# EAGLE design ShieldSchemV22JUSTINV2 (EAGLE 5.10)
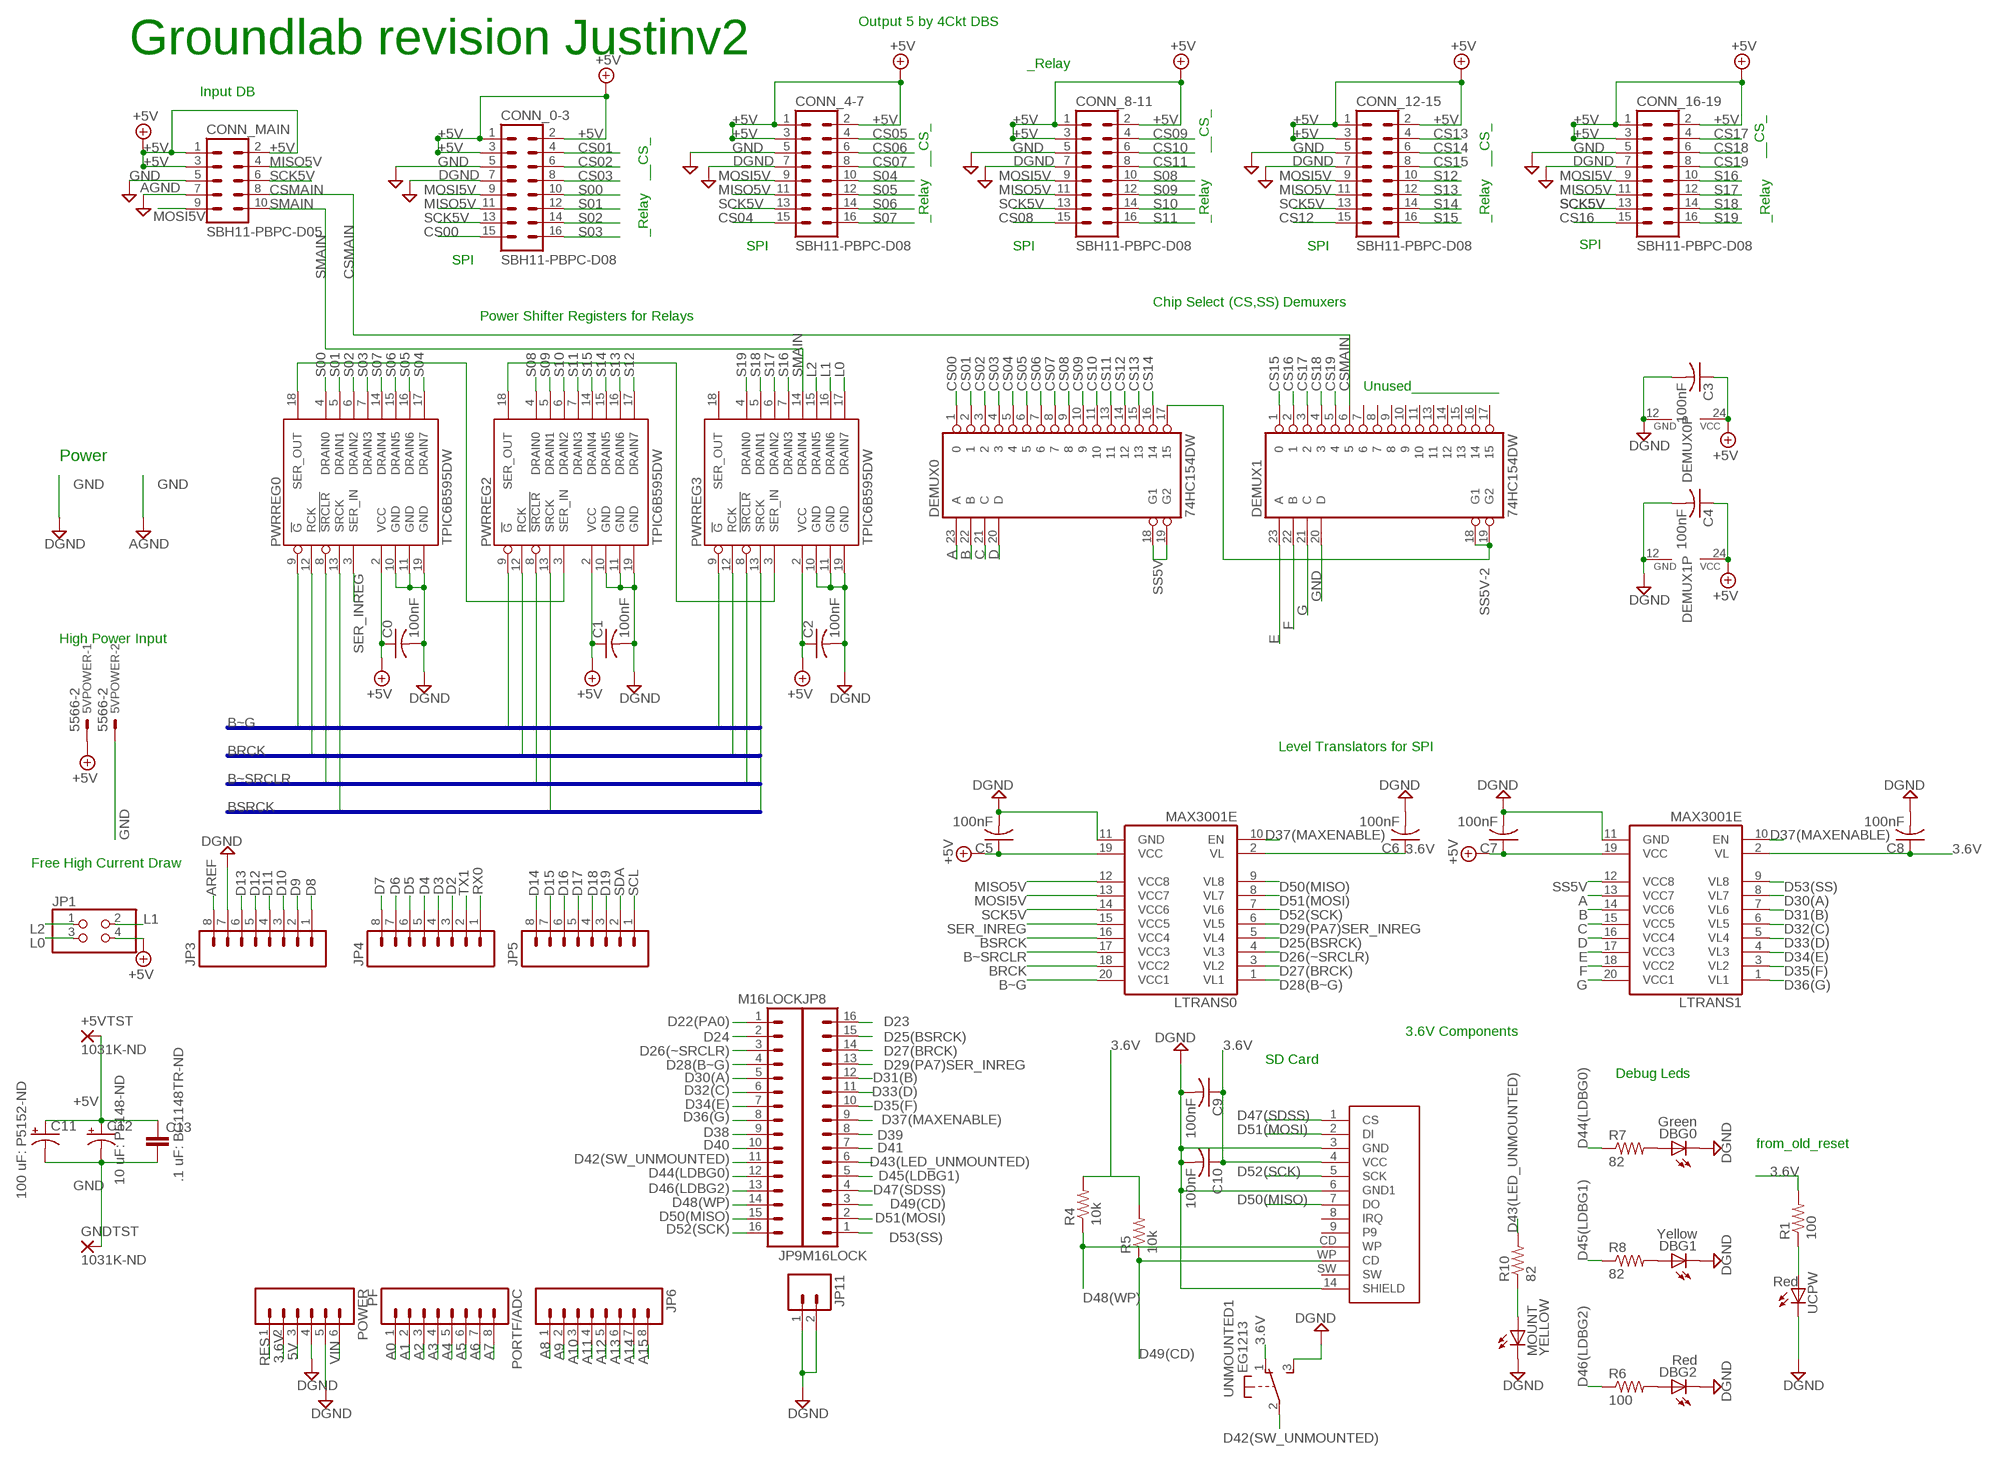
[diagram p0: schematic, sheet 1]

## Parts
5VPOWER  5566-2  [5566-2]
+5VTST  1031K-ND  2,54/0,9  [2,54/0,9]
C0  100nF  C-USC1608  [C1608]
C1  100nF  C-USC1608  [C1608]
C2  100nF  C-USC1608  [C1608]
C3  100nF  C-USC1608  [C1608]
C4  100nF  C-USC1608  [C1608]
C5  100nF  C-USC1608  [C1608]
C6  100nF  C-USC1608  [C1608]
C7  100nF  C-USC1608  [C1608]
C8  100nF  C-USC1608  [C1608]
C9  100nF  C-USC1608  [C1608]
C10  100nF  C-USC1608  [C1608]
C11  100 uF: P5152-ND  CAP_POLPTH1  [CPOL-RADIAL-100UF-25V]
C12  10 uF: P5148-ND  CAP_POLPTH2  [CPOL-RADIAL-10UF-25V]
C13  .1 uF: BC1148TR-ND  CAPPTH  [CAP-PTH-SMALL]
CONN_0-3  SBH11-PBPC-D08  [SBH11-PBPC-D08]
CONN_4-7  SBH11-PBPC-D08  [SBH11-PBPC-D08]
CONN_8-11  SBH11-PBPC-D08  [SBH11-PBPC-D08]
CONN_12-15  SBH11-PBPC-D08  [SBH11-PBPC-D08]
CONN_16-19  SBH11-PBPC-D08  [SBH11-PBPC-D08]
CONN_MAIN  SBH11-PBPC-D05  [SBH11-PBPC-D05]
DBG0  Green  LEDCHIPLED_1206  [CHIPLED_1206]
DBG1  Yellow  LEDCHIPLED_1206  [CHIPLED_1206]
DBG2  Red  LEDCHIPLED_1206  [CHIPLED_1206]
DEMUX0  74HC154DW  [SO24W]
DEMUX1  74HC154DW  [SO24W]
GNDTST  1031K-ND  2,54/0,9  [2,54/0,9]
JP1  PINHD-2X2  [2X02]
JP3  M08LOCK  [1X08_LOCK]
JP4  M08LOCK  [1X08_LOCK]
JP5  M08LOCK  [1X08_LOCK]
JP6  M08LOCK  [1X08_LOCK]
JP8  M16LOCK  [1X16_LOCK]
JP9  M16LOCK  [1X16_LOCK]
JP11  M02LOCK  [1X02_LOCK]
LTRANS0  MAX3001E  [TSSOP20]
LTRANS1  MAX3001E  [TSSOP20]
MOUNT  YELLOW  LED5MM  [LED5MM]
PORTF/ADC  PF  M08LOCK  [1X08_LOCK]
POWER  M06LOCK  [1X06_LOCK]
PWRREG0  TPIC6B595DW  [SO20W]
PWRREG2  TPIC6B595DW  [SO20W]
PWRREG3  TPIC6B595DW  [SO20W]
R1  100  RESISTOR1206  [1206]
R4  10k  R-US_R1206  [R1206]
R5  10k  R-US_R1206  [R1206]
R6  100  R-US_R1206  [R1206]
R7  82  R-US_R1206  [R1206]
R8  82  R-US_M1206  [M1206]
R10  82  R-US_R1206  [R1206]
U$3  SD_CARD_SOCKETEASY_SOLDER  [SD-MMC_SOCKET-PP_SHORT_BUS]
UCPW  Red  LED1206  [LED-1206]
UNMOUNTED  EG1213  [EG1213]

## Nets
3.6V: C6.1 C8.1 C9.1 C10.1 LTRANS0.2(VL) LTRANS1.2(VL) POWER.2 R1.2 R4.2 R5.2 U$3.4(VCC) UNMOUNTED.1(1:O)
5V: POWER.3
+5V [+5v]: 5VPOWER.1 +5VTST.1(P) C0.1 C1.1 C2.1 C3.1 C4.1 C5.1 C7.1 C11.1(+) C12.1(+) C13.1 CONN_0-3.1 CONN_0-3.2 CONN_0-3.3 CONN_4-7.1 CONN_4-7.2 CONN_4-7.3 CONN_8-11.1 CONN_8-11.2 CONN_8-11.3 CONN_12-15.1 CONN_12-15.2 CONN_12-15.3 CONN_16-19.1 CONN_16-19.2 CONN_16-19.3 CONN_MAIN.1 CONN_MAIN.2 CONN_MAIN.3 DEMUX0.24(VCC) DEMUX1.24(VCC) JP1.4 LTRANS0.19(VCC) LTRANS1.19(VCC) PWRREG0.2(VCC) PWRREG2.2(VCC) PWRREG3.2(VCC)
A: DEMUX0.23(A) LTRANS1.13(VCC7)
A0: PORTF/ADC.1
A1: PORTF/ADC.2
A2: PORTF/ADC.3
A3: PORTF/ADC.4
A4: PORTF/ADC.5
A5: PORTF/ADC.6
A6: PORTF/ADC.7
A7: PORTF/ADC.8
A8: JP6.1
A9: JP6.2
A10: JP6.3
A11: JP6.4
A12: JP6.5
A13: JP6.6
A14: JP6.7
A15: JP6.8
AREF: JP3.8
B: DEMUX0.22(B) LTRANS1.14(VCC6)
BRCK: LTRANS0.18(VCC2) PWRREG0.12(RCK) PWRREG2.12(RCK) PWRREG3.12(RCK)
BSRCK: LTRANS0.16(VCC4) PWRREG0.13(SRCK) PWRREG2.13(SRCK) PWRREG3.13(SRCK)
B~G: LTRANS0.20(VCC1) PWRREG0.9(!G) PWRREG2.9(!G) PWRREG3.9(!G)
B~SRCLR: LTRANS0.17(VCC3) PWRREG0.8(!SRCLR) PWRREG2.8(!SRCLR) PWRREG3.8(!SRCLR)
C: DEMUX0.21(C) LTRANS1.15(VCC5)
CS00: CONN_0-3.15 DEMUX0.1
CS01: CONN_0-3.4 DEMUX0.2
CS02: CONN_0-3.6 DEMUX0.3
CS03: CONN_0-3.8 DEMUX0.4
CS04: CONN_4-7.15 DEMUX0.5
CS05: CONN_4-7.4 DEMUX0.6
CS06: CONN_4-7.6 DEMUX0.7
CS07: CONN_4-7.8 DEMUX0.8
CS08: CONN_8-11.15 DEMUX0.9
CS09: CONN_8-11.4 DEMUX0.10
CS10: CONN_8-11.6 DEMUX0.11
CS11: CONN_8-11.8 DEMUX0.13
CS12: CONN_12-15.15 DEMUX0.14
CS13: CONN_12-15.4 DEMUX0.15
CS14: CONN_12-15.6 DEMUX0.16
CS15: CONN_12-15.8 DEMUX1.1
CS16: CONN_16-19.15 DEMUX1.2
CS17: CONN_16-19.4 DEMUX1.3
CS18: CONN_16-19.6 DEMUX1.4
CS19: CONN_16-19.8 DEMUX1.5
CSMAIN: CONN_MAIN.8 DEMUX1.6
D: DEMUX0.20(D) LTRANS1.16(VCC4)
D2: JP4.3
D3: JP4.4
D4: JP4.5
D5: JP4.6
D6: JP4.7
D7: JP4.8
D8: JP3.1
D9: JP3.2
D10: JP3.3
D11: JP3.4
D12: JP3.5
D13: JP3.6
D14: JP5.8
D15: JP5.7
D16: JP5.6
D17: JP5.5
D18: JP5.4
D19: JP5.3
D22(PA0): JP9.1
D23: JP8.16
D24: JP9.2
D25(BSRCK): JP8.15 LTRANS0.5(VL4)
D26(~SRCLR): JP9.3 LTRANS0.4(VL3)
D27(BRCK): JP8.14 LTRANS0.3(VL2)
D28(B~G): JP9.4 LTRANS0.1(VL1)
D29(PA7)SER_INREG: JP8.13 LTRANS0.6(VL5)
D30(A): JP9.5 LTRANS1.8(VL7)
D31(B): JP8.12 LTRANS1.7(VL6)
D32(C): JP9.6 LTRANS1.6(VL5)
D33(D): JP8.11 LTRANS1.5(VL4)
D34(E): JP9.7 LTRANS1.4(VL3)
D35(F): JP8.10 LTRANS1.3(VL2)
D36(G): JP9.8 LTRANS1.1(VL1)
D37(MAXENABLE): JP8.9 LTRANS0.10(EN) LTRANS1.10(EN)
D38: JP9.9
D39: JP8.8
D40: JP9.10
D41: JP8.7
D42(SW_UNMOUNTED): JP9.11 UNMOUNTED.2(1:P)
D43(LED_UNMOUNTED): JP8.6 R10.2
D44(LDBG0): JP9.12 R7.1
D45(LDBG1): JP8.5 R8.1
D46(LDBG2): JP9.13 R6.1
D47(SDSS): JP8.4 U$3.1(CS)
D48(WP): JP9.14 R4.1 U$3.CD(WP)
D49(CD): JP8.3 R5.1 U$3.WP(CD)
D50(MISO): JP9.15 LTRANS0.9(VL8) U$3.7(DO)
D51(MOSI): JP8.2 LTRANS0.8(VL7) U$3.2(DI)
D52(SCK): JP9.16 LTRANS0.7(VL6) U$3.5(SCK)
D53(SS): JP8.1 LTRANS1.9(VL8)
E: DEMUX1.23(A) LTRANS1.17(VCC3)
F: DEMUX1.22(B) LTRANS1.18(VCC2)
G: DEMUX1.21(C) LTRANS1.20(VCC1)
GND: 5VPOWER.2 C0.2 C1.2 C2.2 C3.2 C4.2 C5.2 C6.2 C7.2 C8.2 C9.2 C10.2 C11.2(-) C12.2(-) C13.2 CONN_0-3.5 CONN_0-3.7 CONN_4-7.5 CONN_4-7.7 CONN_8-11.5 CONN_8-11.7 CONN_12-15.5 CONN_12-15.7 CONN_16-19.5 CONN_16-19.7 CONN_MAIN.5 CONN_MAIN.7 DBG0.C DBG1.C DBG2.C DEMUX0.12(GND) DEMUX1.12(GND) DEMUX1.20(D) GNDTST.1(P) JP3.7 JP11.1 JP11.2 LTRANS0.11(GND) LTRANS1.11(GND) MOUNT.K(C) POWER.4 POWER.5 PWRREG0.10(GND) PWRREG0.11(GND) PWRREG0.19(GND) PWRREG2.10(GND) PWRREG2.11(GND) PWRREG2.19(GND) PWRREG3.10(GND) PWRREG3.11(GND) PWRREG3.19(GND) U$3.3(GND) U$3.6(GND1) U$3.14(SHIELD) UCPW.C UNMOUNTED.3(1:S) ; supply symbol labelled DGND, AGND
L0: JP1.3 PWRREG3.17(DRAIN7)
L1: JP1.2 PWRREG3.16(DRAIN6)
L2: JP1.1 PWRREG3.15(DRAIN5)
MISO5V: CONN_0-3.11 CONN_4-7.11 CONN_8-11.11 CONN_12-15.11 CONN_16-19.11 CONN_MAIN.4 LTRANS0.12(VCC8)
MOSI5V: CONN_0-3.9 CONN_4-7.9 CONN_8-11.9 CONN_12-15.9 CONN_16-19.9 CONN_MAIN.9 LTRANS0.13(VCC7)
N$1: PWRREG0.18(SER_OUT) PWRREG2.3(SER_IN)
N$2: PWRREG2.18(SER_OUT) PWRREG3.3(SER_IN)
N$7: DBG2.A R6.2
N$8: DBG0.A R7.2
N$9: DBG1.A R8.2
N$11: MOUNT.A R10.1
N$126: R1.1 UCPW.A
RES: POWER.1
RX0: JP4.1
S00: CONN_0-3.10 PWRREG0.4(DRAIN0)
S01: CONN_0-3.12 PWRREG0.5(DRAIN1)
S02: CONN_0-3.14 PWRREG0.6(DRAIN2)
S03: CONN_0-3.16 PWRREG0.7(DRAIN3)
S04: CONN_4-7.10 PWRREG0.17(DRAIN7)
S05: CONN_4-7.12 PWRREG0.16(DRAIN6)
S06: CONN_4-7.14 PWRREG0.15(DRAIN5)
S07: CONN_4-7.16 PWRREG0.14(DRAIN4)
S08: CONN_8-11.10 PWRREG2.4(DRAIN0)
S09: CONN_8-11.12 PWRREG2.5(DRAIN1)
S10: CONN_8-11.14 PWRREG2.6(DRAIN2)
S11: CONN_8-11.16 PWRREG2.7(DRAIN3)
S12: CONN_12-15.10 PWRREG2.17(DRAIN7)
S13: CONN_12-15.12 PWRREG2.16(DRAIN6)
S14: CONN_12-15.14 PWRREG2.15(DRAIN5)
S15: CONN_12-15.16 PWRREG2.14(DRAIN4)
S16: CONN_16-19.10 PWRREG3.7(DRAIN3)
S17: CONN_16-19.12 PWRREG3.6(DRAIN2)
S18: CONN_16-19.14 PWRREG3.5(DRAIN1)
S19: CONN_16-19.16 PWRREG3.4(DRAIN0)
SCK5V: CONN_0-3.13 CONN_4-7.13 CONN_8-11.13 CONN_12-15.13 CONN_16-19.13 CONN_MAIN.6 LTRANS0.14(VCC6)
SCL: JP5.1
SDA: JP5.2
SER_INREG: LTRANS0.15(VCC5) PWRREG0.3(SER_IN)
SMAIN: CONN_MAIN.10 PWRREG3.14(DRAIN4)
SS5V: DEMUX0.18(G1) DEMUX0.19(G2) LTRANS1.12(VCC8)
SS5V-2: DEMUX0.17 DEMUX1.18(G1) DEMUX1.19(G2)
TX1: JP4.2
VIN: POWER.6
Unconnected: DEMUX1.7 DEMUX1.8 DEMUX1.9 DEMUX1.10 DEMUX1.11 DEMUX1.13 DEMUX1.14 DEMUX1.15 DEMUX1.16 DEMUX1.17 PWRREG3.18(SER_OUT) U$3.8(IRQ) U$3.9 U$3.SW UNMOUNTED.MT1(MT) UNMOUNTED.MT2(MT)

## Buses
BRCK
B~SRCLR
BSRCK
B~G

## Notes on the sheet
- Output 5 by 4Ckt DBS
- Groundlab revision Justinv2
- _Relay
- Input DB
- __CS_
- __CS_
- __CS_ | __CS_
- __CS_
- _Relay | _Relay | _Relay | _Relay
- _Relay
- SPI | SPI | SPI | SPI
- SPI
- Chip Select (CS,SS) Demuxers
- Power Shifter Registers for Relays
- Unused___________
- Power
- High Power Input
- Level Translators for SPI
- Free High Current Draw
- 3.6V Components
- SD Card
- Debug Leds
- from_old_reset

## Library data of the parts
5VPOWER = con-molex:5566-2: Mini FIT connector 2 pol Source: http://www.molex.com
+5VTST GNDTST = wirepad:2,54/0,9: THROUGH-HOLE PAD
C0 C1-C10 = rcl:C-US: CAPACITOR, American symbol
C11 C12 = SparkFun:CAP_POL: Capacitor Polarized These are standard SMD and PTH capacitors. Normally 10uF, 47uF, and 100uF in electrolytic and tantalum varieties. Always verify the external diameter of the through hole cap, it varies with capacity, voltage, and manufacturer. The EIA devices should be standard.
C13 = SparkFun:CAP: Capacitor Standard 0603 ceramic capacitor, and 0.1" leaded capacitor.
CONN_0-3 CONN_4-7 CONN_8-11 CONN_12-15 CONN_16-19 = con-sullins:SBH11-PBPC-D08: HEADER - Vertical, Shrouded
CONN_MAIN = con-sullins:SBH11-PBPC-D05: HEADER - Vertical, Shrouded
DBG0 DBG1 DBG2 MOUNT = led:LED: LED OSRAM: - CHIPLED LG R971, LG N971, LY N971, LG Q971, LY Q971, LO R971, LY R971 LH N974, LH R974 LS Q976, LO Q976, LY Q976 LO Q996 - Hyper CHIPLED LW Q18S LB Q993, LB Q99A, LB R99A - SideLED LS A670, LO A670, LY A670, LG A670, LP A670 LB A673, LV A673, LT A673, LW A673 LH A674 LY A675 LS A676, LA A676, LO A676, LY A676, LW A676 LS A679, LY A679, LG A679 - Hyper Micro SIDELED® LS Y876, LA Y876, LO Y876, LY Y876 LT Y87S - SmartLED LW L88C, LW L88S LB L89C, LB L89S, LG L890 LS L89K, LO L89K, LY L89K LS L896, LA L896, LO L896, LY L896 - TOPLED LS T670, LO T670, LY T670, LG T670, LP T670 LSG T670, LSP T670, LSY T670, LOP T670, LYG T670 LG T671, LOG T671, LSG T671 LB T673, LV T673, LT T673, LW T673 LH T674 LS T676, LA T676, LO T676, LY T676, LB T676, LH T676, LSB T676, LW T676 LB T67C, LV T67C, LT T67C, LS T67K, LO T67K, LY T67K, LW E67C LS E67B, LA E67B, LO E67B, LY E67B, LB E67C, LV E67C, LT E67C LW T67C LS T679, LY T679, LG T679 LS T770, LO T770, LY T770, LG T770, LP T770 LB T773, LV T773, LT T773, LW T773 LH T774 LS E675, LA E675, LY E675, LS T675 LS T776, LA T776, LO T776, LY T776, LB T776 LHGB T686 LT T68C, LB T68C - Hyper Mini TOPLED® LB M676 - Mini TOPLED Santana® LG M470 LS M47K, LO M47K, LY M47K Source: http://www.osram.convergy.de LUXEON: - LUMILED® LXK2-PW12-R00, LXK2-PW12-S00, LXK2-PW14-U00, LXK2-PW14-V00 LXK2-PM12-R00, LXK2-PM12-S00, LXK2-PM14-U00 LXK2-PE12-Q00, LXK2-PE12-R00, LXK2-PE12-S00, LXK2-PE14-T00, LXK2-PE14-U00 LXK2-PB12-K00, LXK2-PB12-L00, LXK2-PB12-M00, LXK2-PB14-N00, LXK2-PB14-P00, LXK2-PB14-Q00 LXK2-PR12-L00, LXK2-PR12-M00, LXK2-PR14-Q00, LXK2-PR14-R00 LXK2-PD12-Q00, LXK2-PD12-R00, LXK2-PD12-S00 LXK2-PH12-R00, LXK2-PH12-S00 LXK2-PL12-P00, LXK2-PL12-Q00, LXK2-PL12-R00 Source: www.luxeon.com KINGBRIGHT: KA-3528ASYC Source: www.kingbright.com
DEMUX0 DEMUX1 = 74xx-eu:74*154: 4-line to 16-line data SELECTOR/MULTIPLEXER
JP1 = pinhead:PINHD-2X2: PIN HEADER
JP3-JP6 PORTF/ADC = SparkFun:M08: Header 8 Standard 8-pin 0.1" header. Use with straight break away headers (SKU : PRT-00116), right angle break away headers (PRT-00553), swiss pins (PRT-00743), machine pins (PRT-00117), and female headers (PRT-00115).
JP8 JP9 = SparkFun:M16
JP11 = SparkFun:M02: Header 2 Standard 2-pin 0.1" header. Use with straight break away headers (SKU : PRT-00116), right angle break away headers (PRT-00553), swiss pins (PRT-00743), machine pins (PRT-00117), and female headers (PRT-00115). Molex polarized connector foot print use with SKU : PRT-08233 with associated crimp pins and housings.
LTRANS0 LTRANS1 = MAX3001E:MAX3001E
POWER = SparkFun:M06: Header 6 Standard 6-pin 0.1" header. Use with straight break away headers (SKU : PRT-00116), right angle break away headers (PRT-00553), swiss pins (PRT-00743), machine pins (PRT-00117), and female headers (PRT-00115). Molex polarized connector foot print use with SKU : PRT-08094 with associated crimp pins and housings. NOTES ON THE VARIANTS LOCK and LOCK_LONGPADS... This footprint was designed to help hold the alignment of a through-hole component (i.e. 6-pin header) while soldering it into place. You may notice that each hole has been shifted either up or down by 0.005 of an inch from it's more standard position (which is a perfectly straight line). This slight alteration caused the pins (the squares in the middle) to touch the edges of the holes. Because they are alternating, it causes a "brace" to hold the component in place. 0.005 has proven to be the perfect amount of "off-center" position when using our standard breakaway headers. Although looks a little odd when you look at the bare footprint, once you have a header in there, the alteration is very hard to notice. Also, if you push a header all the way into place, it is covered up entirely on the bottom side. This idea of altering the position of holes to aid alignment will be further integrated into the Sparkfun Library for other footprints. It can help hold any component with 3 or more connection pins.
PWRREG0 PWRREG2 PWRREG3 = TPIC6B595:TPIC6B595
R1 = SparkFun:RESISTOR: Resistor Basic schematic elements and footprints for 0603, 1206, and PTH 1/10th watt (small) resistors.
R4-R8 R10 = rcl:R-US_: RESISTOR, American symbol
U$3 = SparkFun:SD_CARD_SOCKET: SD/MMC Socket Media socket for SD and MMC cards. Push-push type. Schematic element and footprint production proven. Spark Fun Electronics SKU : PRT-00136
UCPW = SparkFun:LED: LEDs Standard schematic elements and footprints for 5mm, 3mm, 1206, and 0603 sized LEDs. 5mm - Spark Fun Electronics SKU : COM-00529 (and others)
UNMOUNTED = adafruit:EG1213: E-Switch right-angle slide SPDT Part #EG1213 http://www.ladyada.net/library/eagle

## Net classes
0 default: width 0.254 mm, drill 0.61 mm, clearance 0.254 mm
1 +5v: width 1.27 mm, drill 0.61 mm
2 GND: width 1.27 mm, drill 0.61 mm

## Board
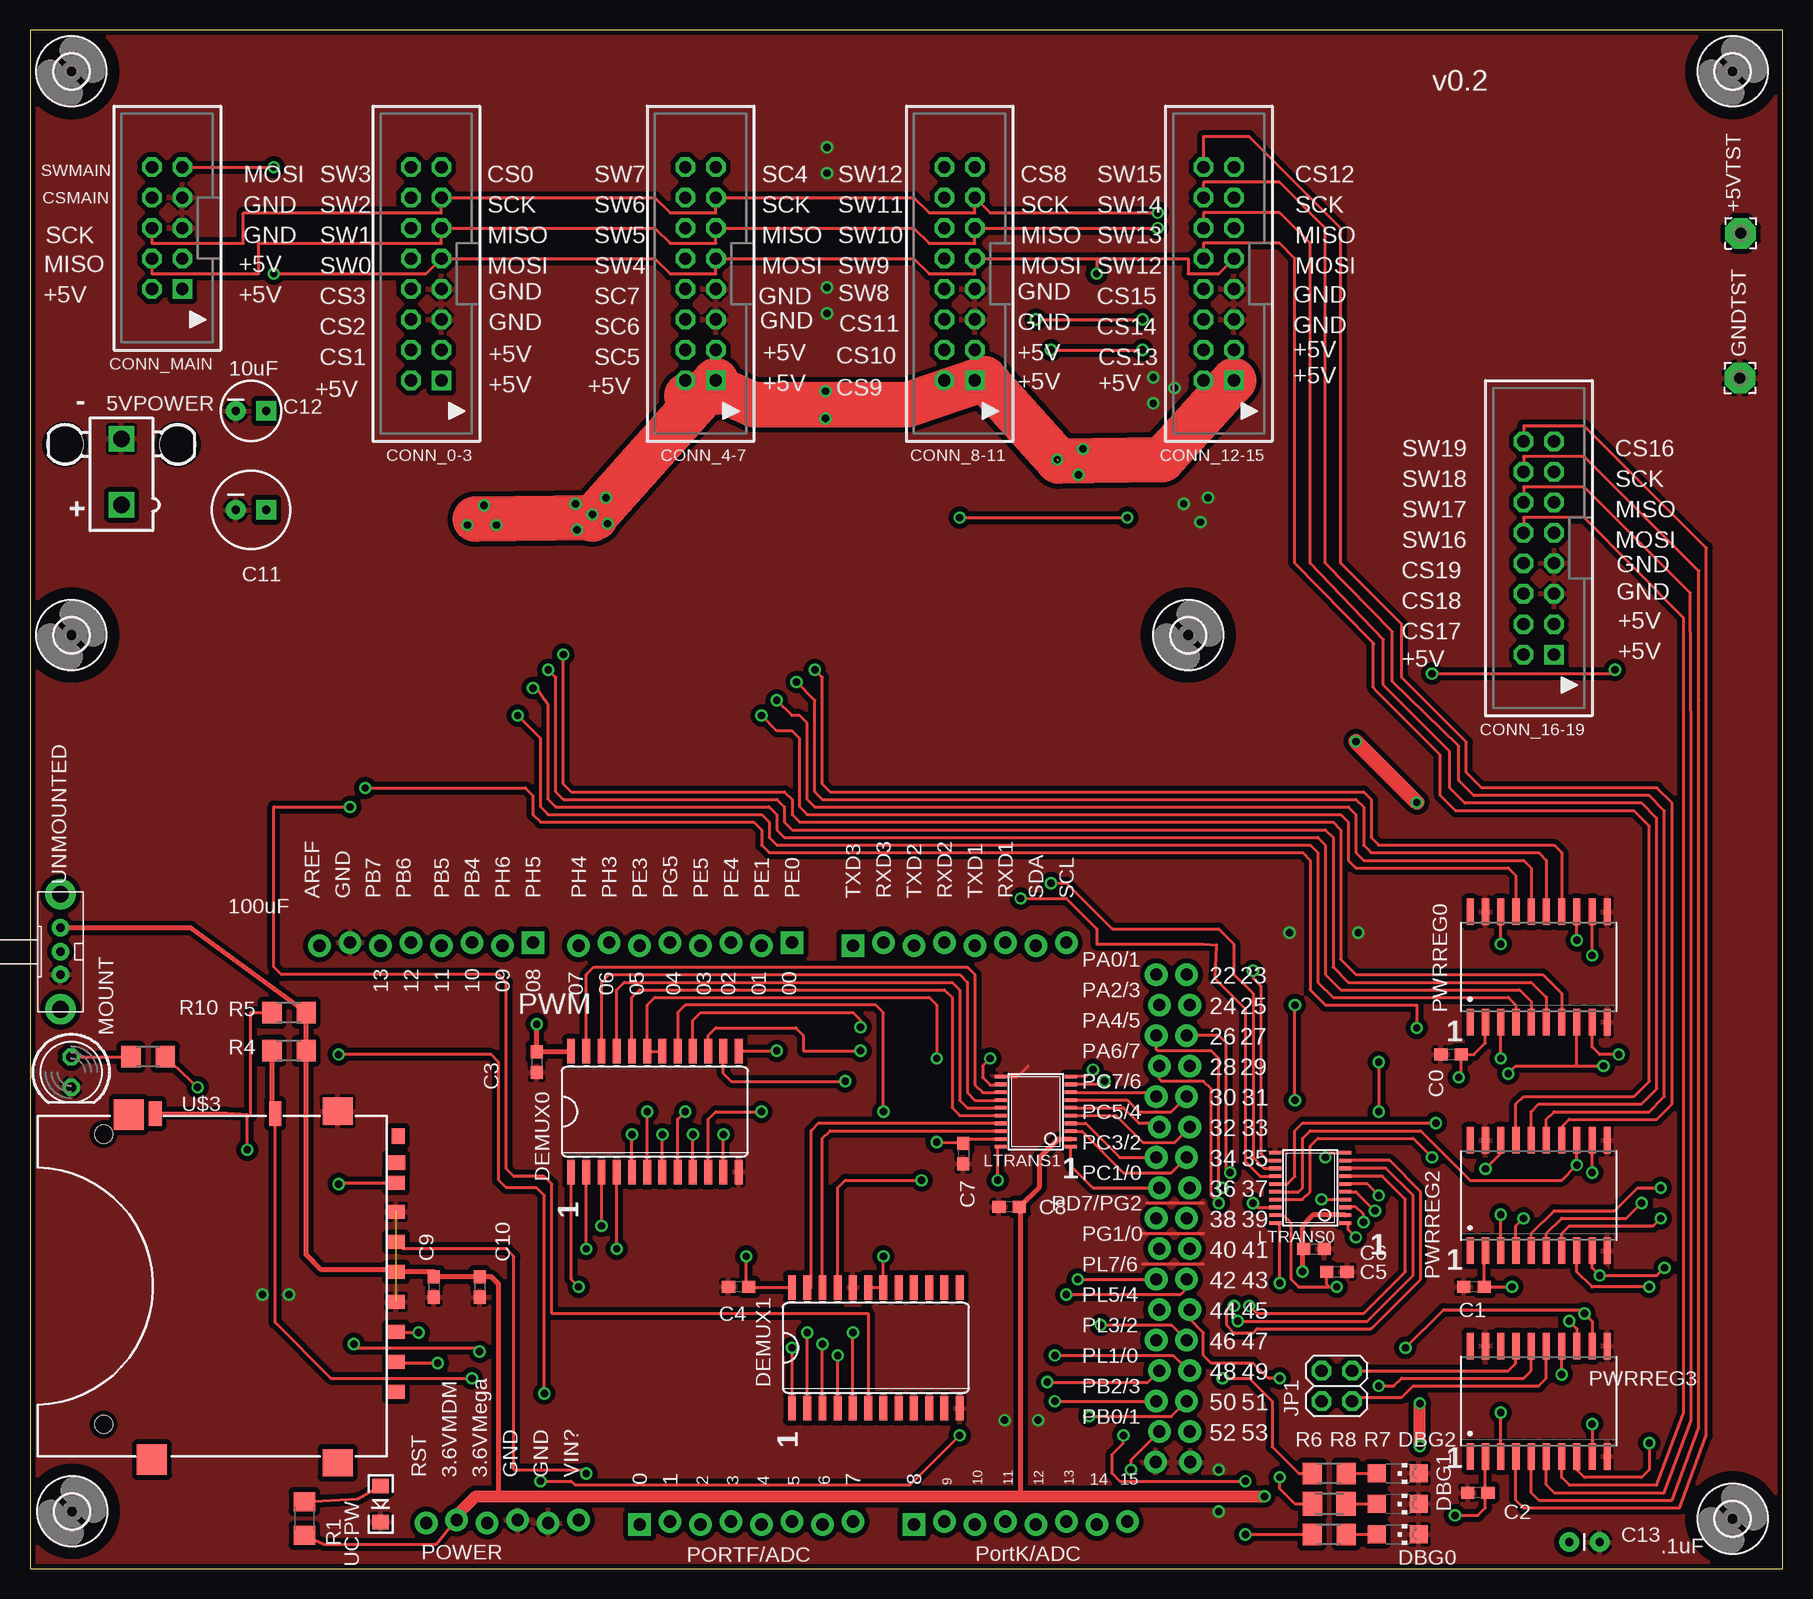
[diagram p1: board, top side]
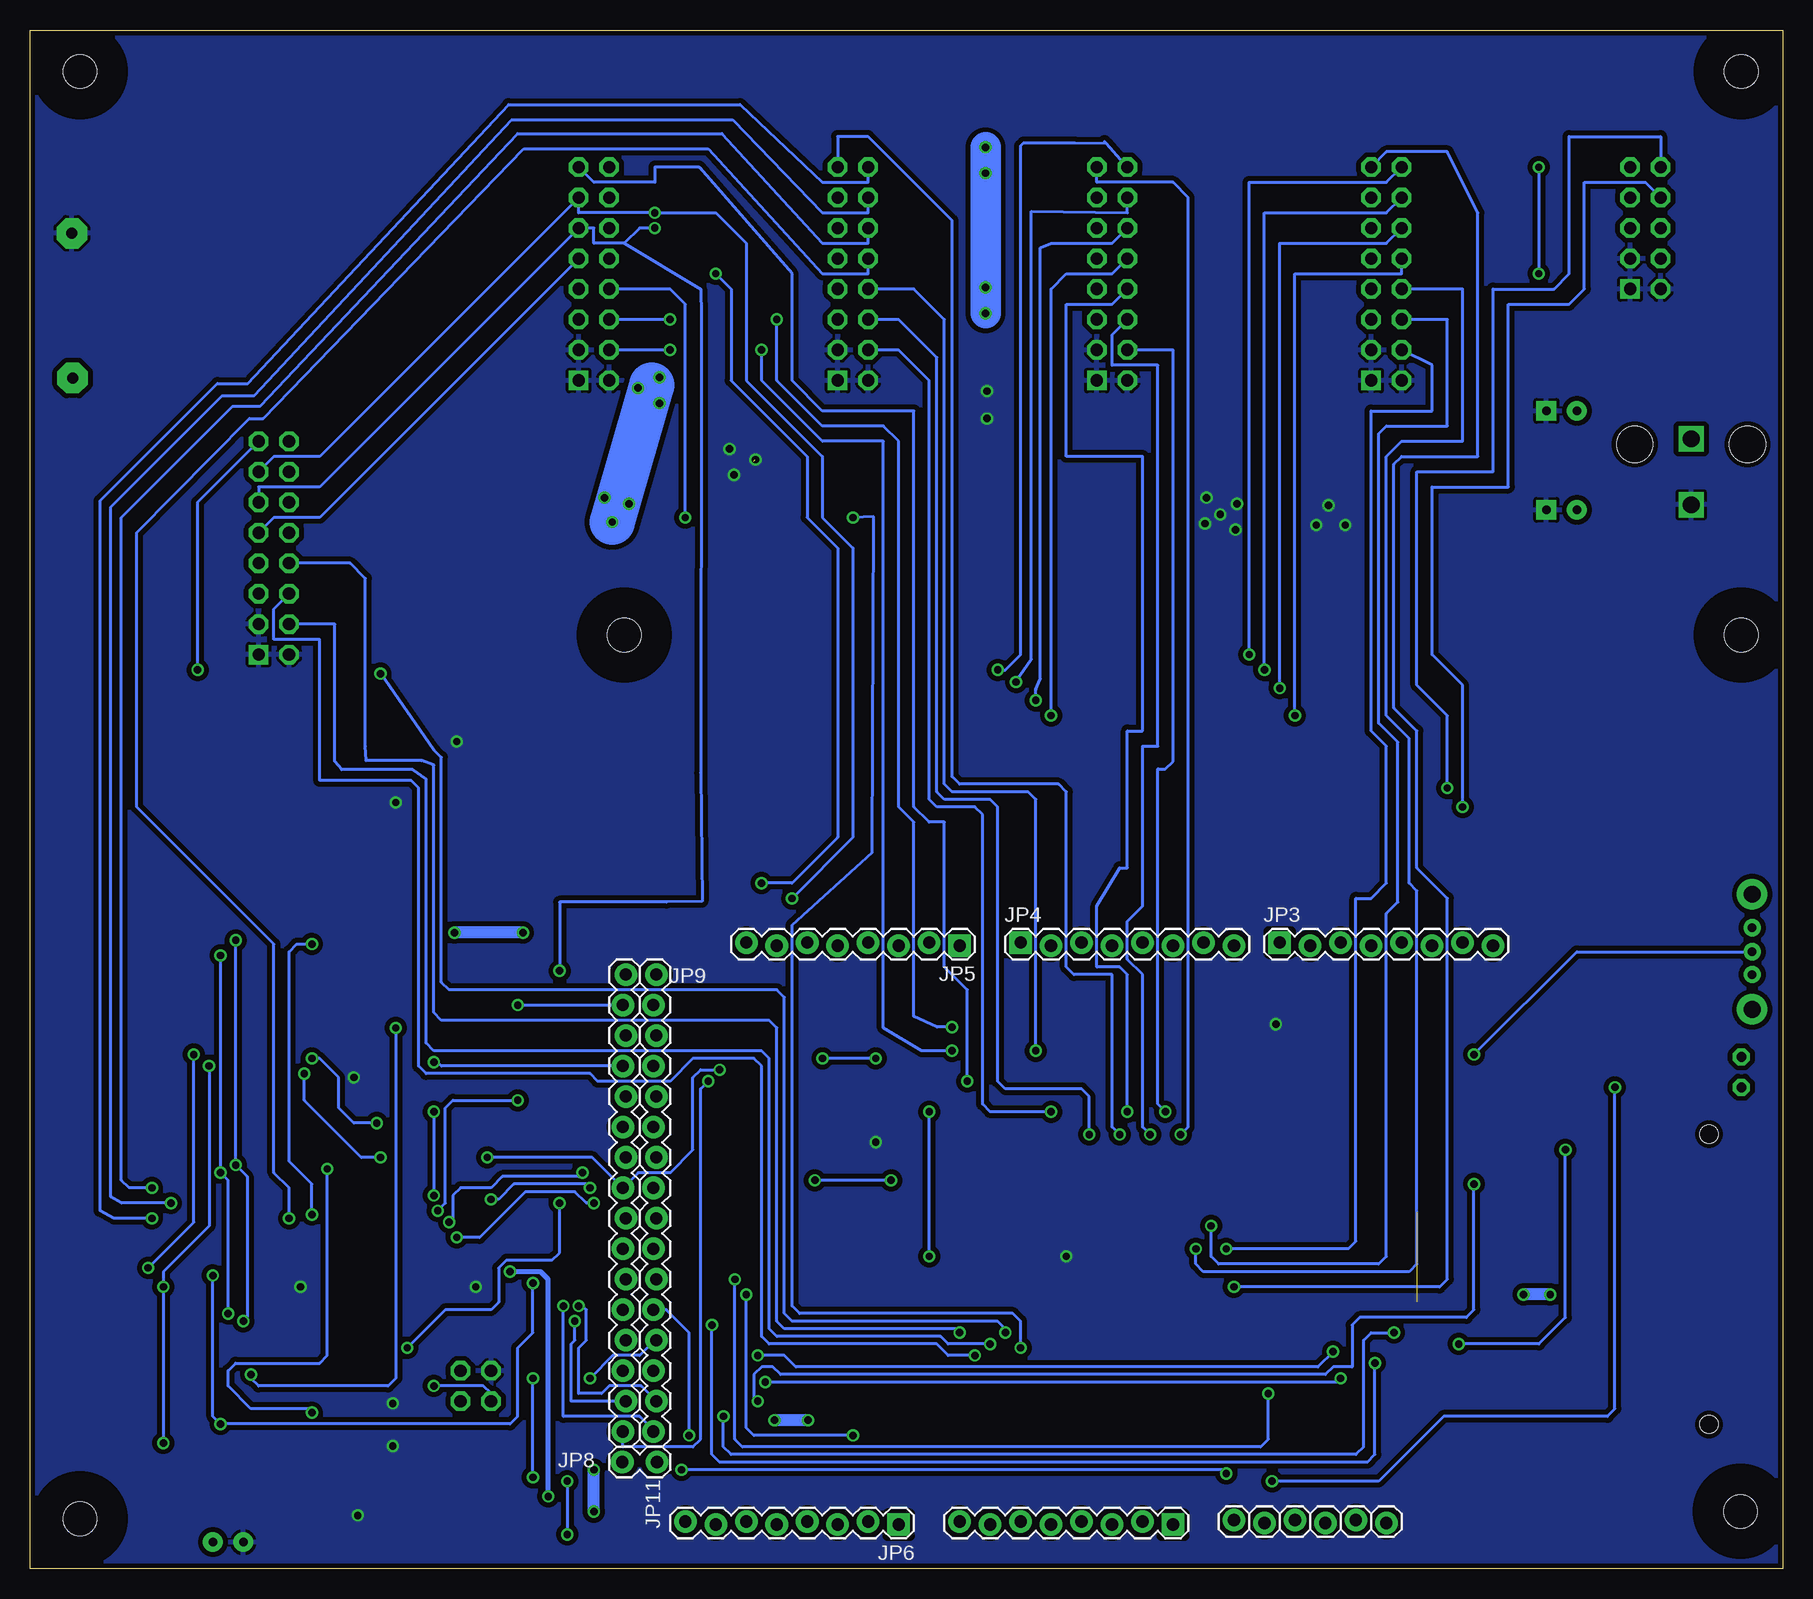
[diagram p2: board, bottom side, seen from below]

Size 146.05 x 128.27 mm. Coordinates in mm from the lower left corner, seen from the top.
Outline: 0,0 146.05,0 146.05,128.27 0,128.27 0,0
Copper layers (1*16): Top 0.035mm / dielectric 1.5mm / Bottom 0.035mm
Design rules "pcbfabexpress *": minimum track width 8mil, minimum drill 10mil, track to track 8mil, track to pad 8mil, pad to pad 8mil, via to via 8mil, smd to smd 8mil, copper to edge 10mil, drill to drill 8mil, minimum pad ring 12mil, minimum via ring 8mil, stop-mask expansion 4mil, vias tented up to drill 50mil, thermal gap 10mil

### Footprints (pad centres in the part's own frame; a part is rotated, then mirrored left to right if it is on the bottom)
5566-2 = drill 1.4 square: 1 0,-2.75; 2 0,2.75 | hole 3: 4.7,2.29; -4.7,2.29
2,54/0,9 = drill 0.914 pad 2.54 octagon: 1 0,0
C1608 = smd 1.1 x 1: 1 -0.85,0; 2 0.85,0
CPOL-RADIAL-100UF-25V = drill 0.7 pad 1.651 square: 1 1.27,0 | drill 0.7 pad 1.651 round: 2 -1.27,0
CPOL-RADIAL-10UF-25V = drill 0.7 pad 1.651 square: 1 1.27,0 | drill 0.7 pad 1.651 round: 2 -1.27,0
CAP-PTH-SMALL = drill 0.7 pad 1.651 round: 1 0,0; 2 2.54,0
SBH11-PBPC-D08 = drill 1.016 square: 1 -8.89,-1.27 | drill 1.016 octagon: 2 -8.89,1.27; 3 -6.35,-1.27; 4 -6.35,1.27; 5 -3.81,-1.27; 6 -3.81,1.27; 7 -1.27,-1.27; 8 -1.27,1.27; 9 1.27,-1.27; 10 1.27,1.27; 11 3.81,-1.27; 12 3.81,1.27; 13 6.35,-1.27; 14 6.35,1.27; 15 8.89,-1.27; 16 8.89,1.27
SBH11-PBPC-D05 = drill 1.016 square: 1 -5.08,-1.27 | drill 1.016 octagon: 2 -5.08,1.27; 3 -2.54,-1.27; 4 -2.54,1.27; 5 0,-1.27; 6 0,1.27; 7 2.54,-1.27; 8 2.54,1.27; 9 5.08,-1.27; 10 5.08,1.27
CHIPLED_1206 = smd 1.5 x 1.5: A 0,-1.75; C 0,1.75
SO24W = smd 0.66 x 2.032: 1 -6.985,-5.029; 2 -5.715,-5.029; 3 -4.445,-5.029; 4 -3.175,-5.029; 5 -1.905,-5.029; 6 -0.635,-5.029; 7 0.635,-5.029; 8 1.905,-5.029; 9 3.175,-5.029; 10 4.445,-5.029; 11 5.715,-5.029; 12 6.985,-5.029; 13 6.985,5.029; 14 5.715,5.029; 15 4.445,5.029; 16 3.175,5.029; 17 1.905,5.029; 18 0.635,5.029; 19 -0.635,5.029; 20 -1.905,5.029; 21 -3.175,5.029; 22 -4.445,5.029; 23 -5.715,5.029; 24 -6.985,5.029
2X02 = drill 1.016 octagon: 1 -1.27,-1.27; 2 -1.27,1.27; 3 1.27,-1.27; 4 1.27,1.27
1X08_LOCK = drill 1.016 pad 1.88 square: 1 0,0.127 | drill 1.016 pad 1.88 round: 2 2.54,-0.127; 3 5.08,0.127; 4 7.62,-0.127; 5 10.16,0.127; 6 12.7,-0.127; 7 15.24,0.127; 8 17.78,-0.127
1X16_LOCK = drill 1.016 pad 1.88 round: 1 0,0.127; 2 2.54,-0.127; 3 5.08,0.127; 4 7.62,-0.127; 5 10.16,0.127; 6 12.7,-0.127; 7 15.24,0.127; 8 17.78,-0.127; 9 20.32,0.127; 10 22.86,-0.127; 11 25.4,0.127; 12 27.94,-0.127; 13 30.48,0.127; 14 33.02,-0.127; 15 35.56,0.127; 16 38.1,-0.127
1X02_LOCK = drill 1.016 pad 1.88 round: 1 -0.178,0; 2 2.718,0
TSSOP20 = smd 0.305 x 0.991: 1 -2.925,-2.918; 2 -2.275,-2.918; 3 -1.625,-2.918; 4 -0.975,-2.918; 5 -0.325,-2.918; 6 0.325,-2.918; 7 0.975,-2.918; 8 1.625,-2.918; 9 2.275,-2.918; 10 2.925,-2.918; 11 2.925,2.918; 12 2.275,2.918; 13 1.625,2.918; 14 0.975,2.918; 15 0.325,2.918; 16 -0.325,2.918; 17 -0.975,2.918; 18 -1.625,2.918; 19 -2.275,2.918; 20 -2.925,2.918
LED5MM = drill 0.813 octagon: A -1.27,0; K 1.27,0
1X06_LOCK = drill 1.016 pad 1.88 round: 1 0,0; 2 2.54,-0.254; 3 5.08,0; 4 7.62,-0.254; 5 10.16,0; 6 12.7,-0.254
SO20W = smd 0.6 x 2.2: 1 -5.715,-4.6; 2 -4.445,-4.6; 3 -3.175,-4.6; 4 -1.905,-4.6; 5 -0.635,-4.6; 6 0.635,-4.6; 7 1.905,-4.6; 8 3.175,-4.6; 9 4.445,-4.6; 10 5.715,-4.6; 11 5.715,4.6; 12 4.445,4.6; 13 3.175,4.6; 14 1.905,4.6; 15 0.635,4.6; 16 -0.635,4.6; 17 -1.905,4.6; 18 -3.175,4.6; 19 -4.445,4.6; 20 -5.715,4.6
1206 = smd 1.6 x 1.8: 1 -1.4,0; 2 1.4,0
R1206 = smd 1.6 x 1.803: 1 -1.422,0; 2 1.422,0
M1206 = smd 1.6 x 2: 1 -1.4,0; 2 1.4,0
2,8 = hole 2.8: 0,0
SD-MMC_SOCKET-PP_SHORT_BUS = smd 1.2 x 1.5: 1 6.88,29.85; 2 4.38,29.85; 3 1.88,29.85; 4 -0.62,29.85; 5 -3.12,29.85; 6 -5.62,29.85; 7 -8.04,29.85; 8 -9.728,29.87; 9 9.38,29.85 | smd 2.54 x 2.5: 12 -13.735,7.6; 13 15.037,9.525 | smd 2.286 x 2.5: 14 -14,25; 15 15.3,25 | smd 2.032 x 1: CD -13.815,19.8 | smd 1.3 x 1.1: SW -11.938,30.048 | smd 2.032 x 1.05: WP -13.815,9.8 | hole 1.5: -12.1,5.5; 12.1,5.5
LED-1206 = smd 1.2 x 1.4: A -1.5,0; C 1.5,0
EG1213 = drill 0.7 pad 1.422 round: 1 -2,0; 2 0,0; 3 1.9,0 | drill 1.4 pad 2.54 round: MT1 -4.8,0; MT2 4.8,0

### Placement (x,y rotation side)
5VPOWER  7.62,91.44 0 top
+5VTST  142.56,111.32 90 top
C0  118.43,42.86 180 top
C1  120.33,23.5 180 top
C2  120.65,6.35 180 top
C3  42.23,42.23 270 top
C4  59.05,23.5 180 top
C5  108.9,24.77 0 top
C6  107,26.67 0 top
C7  77.79,34.61 270 top
C8  81.6,30.16 180 top
C9  33.66,23.5 270 top
C10  37.47,23.5 270 top
C11  18.41,88.27 0 top
C12  18.41,96.52 0 top
C13  128.27,2.22 0 top
CONN_0-3  33.02,107.95 90 top
CONN_4-7  55.88,107.95 90 top
CONN_8-11  77.47,107.95 90 top
CONN_12-15  99.06,107.95 90 top
CONN_16-19  125.73,85.09 90 top
CONN_MAIN  11.43,111.76 90 top
DBG0  113.98,2.86 270 top
DBG1  113.98,5.4 270 top
DBG2  113.98,7.94 270 top
DEMUX0  52.07,38.1 0 top
DEMUX1  70.48,18.41 0 top
GNDTST  142.49,99.25 90 top
JP1  108.9,15.24 90 top
JP3  41.91,52.07 0 bottom
JP4  63.5,52.07 0 bottom
JP5  68.58,52.07 180 bottom
JP6  73.66,3.81 180 bottom
JP8  96.52,11.43 90 bottom
JP9  93.98,49.53 270 bottom
JP11  93.98,8.89 180 bottom
LTRANS0  106.68,31.75 90 top
LTRANS1  83.82,38.1 90 top
MOUNT  3.43,41.4 270 top
PORTF/ADC  50.8,3.81 180 bottom
POWER  33.02,3.81 180 bottom
PWRREG0  125.73,50.17 0 top
PWRREG2  125.73,31.11 0 top
PWRREG3  125.73,13.97 0 top
R1  22.86,4.19 270 top
R4  21.59,43.18 0 top
R5  21.59,46.36 0 top
R6  108.27,7.94 0 top
R7  108.27,2.86 0 top
R8  108.27,5.4 0 top
R10  9.84,42.67 0 top
U$1  [2,8]  3.45,77.83 0 top
U$2  [2,8]  3.51,4.78 0 top
U$3  0.64,24.13 270 top
U$4  [2,8]  96.52,77.83 0 top
U$5  [2,8]  3.45,124.82 0 top
U$6  [2,8]  141.88,124.82 0 top
U$7  [2,8]  141.88,4.17 0 top
UCPW  29.21,5.4 270 top
UNMOUNTED  2.54,51.44 270 top

### Tracks (layer width: path | path; a pad name or v marks a point on that pad's centre or on a via)
3.6V  (via drill 0.61)
  Top 0.254: C9.1 33.66,24.75 | POWER.2 35.5,4.06 33.85,2.03 24.51,2.03 R1.2 | U$3.4 30.47,24.77 | 82.55,30.16 C8.1 | 106.05,26.67 C6.1
  Top 0.406: 33.66,24.75 U$3.4 30.3,24.93 24.28,24.93 23.01,26.2 R4.2 R5.2 13.39,53.44 UNMOUNTED.1 | C9.1 C10.1 38.42,24.34 39.05,23.71 39.05,6.03 | 82.55,6.03 82.55,30.16 | v106.05,24.77 106.05,26.67 106.05,28.57 107,29.53 109.55,29.53 LTRANS0.2 | LTRANS1.2 85.67,35.83 84.14,34.29 84.14,31.85 C8.1
  Top 1.016: POWER.2 35.56,4.45 37.15,6.03 39.05,6.03 82.55,6.03 v102.87,6.03
  Bottom 0.406: v102.87,6.03 102.87,24.13 103.5,24.77 v106.05,24.77
+5V  (via drill 0.61)  (1 unrouted)
  Top 0.254: 121.28,6.35 PWRREG3.2 | 121.28,6.35 C2.1 | 108.27,23.5 v108.9,23.5 | 77.79,35.83 77.69,35.83 | 77.79,35.83 LTRANS1.19 | DEMUX1.24 59.91,23.44 C4.1 59.69,23.5 v59.69,26.04 | v119.06,40.96 119.28,41.17 C0.1 120.33,42.86 121.28,43.82 PWRREG0.2 | 121.28,6.35 121.28,5.08 120.65,4.45 v118.75,4.45 | 108.27,23.5 105.73,23.5 105.09,24.13 105.09,28.84 104.46,29.47 LTRANS0.19 | v123.51,23.5 C1.1 121.18,25.73 121.39,25.93 121.28,26.04 PWRREG2.2 | v75.56,35.56 77.69,35.56 | 77.69,35.56 C7.1 | C5.1 108.05,23.71 108.27,23.5 | 77.69,35.56 77.69,35.72 77.79,35.83
  Top 0.406: v42.23,45.4 C3.1 42.28,43.13 DEMUX0.24
  Top 1.016: v115.82,10.22 v115.82,13.78
  Top 1.27: 79.5,99.19 CONN_8-11.1 78.74,98.68 80.01,98.68 | 37.08,87.5 38.1,86.74 v38.86,86.99 | 54.74,97.79 54.74,98.93 CONN_4-7.2 | 47.12,87.63 46.86,87.5 | v110.49,68.96 v115.57,63.88
  Top 3.81: 54.74,97.79 57.78,98.17 60.33,97.03 73.15,97.03 79.5,99.19 | 80.01,98.68 v85.6,92.46 | 85.72,92.33 94.36,92.46 CONN_12-15.1 | 37.08,87.5 47.12,87.63 | 46.86,87.5 CONN_4-7.1
  other vias: 87.76,93.34 87.38,91.19 66.29,98.17 66.29,95.88 48.13,87.12 48.01,89.28 46.86,87.88 45.47,88.77 45.59,86.61 36.45,86.99 37.85,88.65
  pour Bottom (isolate 0.406): 0,128.27 146.05,128.27 146.05,0 0,0
A
  Top 0.254: DEMUX0.23 46.35,49.53 46.99,50.17 78.11,50.17 78.74,49.53 78.74,40.32 79.38,39.69 80.9,39.69 LTRANS1.13
B
  Top 0.254: DEMUX0.22 47.62,48.9 48.26,49.53 77.47,49.53 78.11,48.9 78.11,39.69 78.74,39.05 80.9,39.05 LTRANS1.14
BRCK  (via drill 0.61)
  Top 0.254: v130.18,51.12 PWRREG0.12 | v130.18,33.02 PWRREG2.12 | PWRREG3.12 130.18,20.64 v129.54,21.27 129.22,21.59 117.79,21.59 v114.62,18.41 | LTRANS0.18 102.27,30.12 v101.92,30.48
  Bottom 0.254: v130.18,51.12 v130.18,33.02 129.54,32.38 v129.54,21.27 | v101.92,30.48 101.92,26.35 102.55,25.72 106.36,25.72 107,25.08 107,22.22 107.63,21.59 111.44,21.59 v114.62,18.41
BSRCK  (via drill 0.61)
  Top 0.254: v128.91,52.39 PWRREG0.13 | PWRREG2.13 v128.91,33.66 127.64,32.38 120.02,32.38 115.89,36.51 106.68,36.51 106.05,35.88 106.05,31.75 105.72,31.43 LTRANS0.16 | v128.27,20.64 128.91,20 PWRREG3.13
  Bottom 0.254: v128.91,52.39 v128.91,33.66 127.95,32.7 127.95,20.95 v128.27,20.64
B~G  (via drill 0.61)
  Top 0.254: v130.18,12.06 PWRREG3.9 | PWRREG2.9 130.18,25.08 v130.81,24.45 135.57,24.45 v136.21,25.08 | v132.4,42.86 130.81,42.86 130.18,43.5 PWRREG0.9 | v104.14,23.81 104.14,28.57 103.89,28.82 LTRANS0.20
  Bottom 0.254: v130.81,24.45 130.81,12.7 v130.18,12.06 106.05,12.06 105.41,12.7 105.41,18.41 104.14,19.68 v104.14,23.81 | v132.4,42.86 132.4,28.89 v136.21,25.08
B~SRCLR  (via drill 0.61)
  Top 0.254: PWRREG2.8 128.91,24.77 130.18,23.5 v134.94,23.5 | PWRREG3.8 128.91,8.26 129.54,7.62 134.3,7.62 134.94,8.26 v134.94,10.48 | 128.91,41.91 PWRREG0.8 | 128.91,41.91 v131.13,41.91 | LTRANS0.17 106.02,30.77 106.68,31.43 106.68,35.24 107.31,35.88 115.25,35.88 v116.84,34.29 | v123.19,41.28 123.83,41.91 128.91,41.91
  Bottom 0.254: v134.94,10.48 v134.94,23.5 134.94,24.77 131.13,28.57 v131.13,41.91 | v116.84,34.29 118.43,34.29 123.19,39.05 v123.19,41.28
C
  Top 0.254: DEMUX0.21 48.9,48.26 49.53,48.9 76.83,48.9 77.47,48.26 77.47,39.05 78.11,38.42 80.9,38.42 LTRANS1.15
CS00  (via drill 0.61)
  Top 0.254: DEMUX0.1 45.09,24.13 v45.72,23.5
  Bottom 0.254: v45.72,23.5 28.57,23.5 27.94,24.13 27.94,55.88 30.48,58.42 30.48,69.85 32.38,71.75 32.38,92.08 31.75,92.71 25.4,92.71 25.4,113.03 27.94,118.11 33.02,118.11 CONN_0-3.15
CS01  (via drill 0.61)
  Top 0.254: v46.35,26.67 DEMUX0.2
  Bottom 0.254: v46.35,26.67 36.2,26.67 35.56,27.3 35.56,55.88 34.29,55.88 33.02,57.15 33.02,68.58 34.29,69.85 34.29,96.52 29.21,96.52 29.21,100.33 CONN_0-3.4
CS02  (via drill 0.61)
  Top 0.254: v47.62,28.57 DEMUX0.3
  Bottom 0.254: v47.62,28.57 47.62,26.04 46.99,25.4 33.66,25.4 33.02,26.04 33.02,54.61 32.07,55.56 32.07,68.9 33.66,70.48 33.66,94.61 33.02,95.25 27.94,95.25 27.94,104.14 CONN_0-3.6
CS03  (via drill 0.61)
  Top 0.254: v48.9,26.67 DEMUX0.4
  Bottom 0.254: v48.9,26.67 48.9,25.4 48.26,24.77 31.11,24.77 30.48,25.4 30.48,56.52 31.11,57.15 31.11,69.21 33.02,71.12 33.02,92.71 31.75,93.98 26.67,93.98 26.67,106.68 CONN_0-3.8
CS04  (via drill 0.61)
  Top 0.254: DEMUX0.5 v50.16,36.2
  Bottom 0.254: v50.16,36.2 49.53,36.83 49.53,114.3 50.8,115.57 57.15,115.57 CONN_4-7.15
CS05  (via drill 0.61)
  Top 0.254: DEMUX0.6 v51.44,38.1
  Bottom 0.254: v51.44,38.1 52.07,38.74 52.07,66.67 51.44,66.67 50.8,67.31 50.8,101.6 CONN_4-7.4
CS06  (via drill 0.61)
  Top 0.254: DEMUX0.7 v52.7,36.2
  Bottom 0.254: v52.7,36.2 53.34,36.83 53.34,49.53 54.61,50.8 54.61,53.98 53.34,55.25 53.34,68.58 52.07,68.58 52.07,100.33 55.88,100.33 55.88,102.87 CONN_4-7.6
CS07  (via drill 0.61)
  Top 0.254: DEMUX0.8 53.98,37.47 v54.61,38.1
  Bottom 0.254: v54.61,38.1 54.61,49.53 55.24,50.17 57.15,50.17 57.15,55.25 55.24,58.42 54.61,58.42 54.61,69.85 53.34,69.85 53.34,92.71 59.69,92.71 59.69,105.41 55.88,105.41 CONN_4-7.8
CS08  (via drill 0.61)
  Top 0.254: DEMUX0.9 v55.24,36.2
  Bottom 0.254: v55.24,36.2 55.88,36.83 55.88,49.53 59.05,49.53 59.69,50.17 59.69,64.77 60.33,65.41 68.58,65.41 69.22,66.04 69.22,112.39 76.2,119.38 78.74,119.38 CONN_8-11.15
CS09  (via drill 0.61)
  Top 0.254: DEMUX0.10 56.52,37.47 57.15,38.1 v60.96,38.1
  Bottom 0.254: v60.96,38.1 66.04,38.1 66.67,38.74 66.67,62.87 67.31,63.5 70.48,63.5 71.12,64.14 71.12,99.06 73.66,101.6 CONN_8-11.4
CS10  (via drill 0.61)
  Top 0.254: DEMUX0.11 v57.78,36.2
  Bottom 0.254: v57.78,36.2 57.78,39.37 58.42,40.01 64.77,40.01 65.41,40.64 65.41,63.5 66.04,64.14 69.85,64.14 70.48,64.77 70.48,100.96 73.66,104.14 CONN_8-11.6
CS11  (via drill 0.61)
  Top 0.254: v62.23,43.18 59.05,43.18 DEMUX0.13
  Bottom 0.254: v62.23,43.18 62.23,64.14 62.87,64.77 69.22,64.77 69.85,65.41 69.85,104.14 72.39,106.68 CONN_8-11.8
CS12  (via drill 0.61)
  Top 0.254: DEMUX0.14 57.78,41.28 58.42,40.64 v67.94,40.64
  Bottom 0.254: v67.94,40.64 67.94,48.26 69.85,50.17 69.85,62.23 71.12,62.23 72.39,63.5 72.39,96.52 80.01,96.52 82.55,99.06 82.55,107.95 90.24,116.78 | 90.24,116.78 90.3,116.84 | CONN_12-15.15 99.06,115.57 93.98,115.57 93.98,116.84 90.31,116.84 90.24,116.78
CS13  (via drill 0.61)
  Top 0.254: DEMUX0.15 56.52,44.45 57.15,45.09 63.82,45.09 64.45,44.45 64.45,43.18 v69.22,43.18 | v85.09,101.6 v92.71,101.6
  Bottom 0.254: v69.22,43.18 71.75,43.18 74.93,45.09 74.93,93.98 80.01,93.98 85.09,99.06 v85.09,101.6 | v92.71,101.6 CONN_12-15.4
CS14  (via drill 0.61)
  Top 0.254: DEMUX0.16 55.24,45.72 55.88,46.36 68.58,46.36 69.22,45.72 v69.22,45.15 | v83.82,104.14 v92.71,104.14
  Bottom 0.254: v69.22,45.15 70.48,45.15 72.39,46.04 72.39,62.23 73.66,63.5 73.66,93.98 74.93,95.25 80.01,95.25 83.82,99.06 v83.82,104.14 | v92.71,104.14 CONN_12-15.6
CS15  (via drill 0.61)
  Top 0.254: DEMUX1.1 v63.5,18.41 | v77.47,87.63 v91.44,87.63
  Bottom 0.254: v63.5,18.41 63.5,20.64 64.14,21.27 81.92,21.27 82.55,21.91 82.55,53.66 75.88,59.69 75.75,87.69 v77.47,87.63 | v91.44,87.63 91.44,105.41 92.71,106.68 CONN_12-15.8
CS16  (via drill 0.61)
  Top 0.254: DEMUX1.2 v64.77,19.68 | v116.84,74.61 131.76,74.61 v132.08,74.93
  Bottom 0.254: v64.77,19.68 64.77,20 65.41,20.64 82.55,20.64 83.19,21.27 83.19,47.62 83.82,48.26 111.12,48.26 111.76,48.9 111.76,67.63 112.39,68.26 v116.84,74.61 | v132.08,74.93 132.08,88.9 CONN_16-19.15
CS17  (via drill 0.61)
  Top 0.254: DEMUX1.3 v66.04,18.73
  Bottom 0.254: v66.04,18.73 69.53,18.73 70.17,19.37 83.82,19.37 84.45,20 84.45,42.55 85.09,43.18 112.39,43.18 113.03,43.82 113.03,65.85 114.17,66.61 120.08,66.61 120.65,67.31 120.65,78.74 CONN_16-19.4
CS18  (via drill 0.61)
  Top 0.254: DEMUX1.4 v67.31,17.78
  Bottom 0.254: v67.31,17.78 69.53,17.78 70.48,18.73 84.45,18.73 85.09,19.37 85.09,41.91 85.72,42.55 90.81,42.55 92.71,40.64 98.74,40.64 99.38,41.28 113.03,41.28 113.67,41.91 113.67,65.09 114.3,65.72 121.92,65.72 121.92,77.47 125.73,77.47 125.73,80.01 CONN_16-19.6
CS19  (via drill 0.61)
  Top 0.254: DEMUX1.5 v68.58,19.68
  Bottom 0.254: v68.58,19.68 68.9,20 83.19,20 83.82,20.64 83.82,45.09 84.45,45.72 111.76,45.72 112.39,46.36 112.39,66.99 113.41,67.37 118.05,67.37 118.11,68.58 118.11,82.55 119.38,83.82 CONN_16-19.8
CSMAIN  (via drill 0.61)
  Top 0.254: DEMUX1.6 69.85,21.27 43.5,21.27 43.5,32.07 42.86,32.7 40.32,32.7 39.69,33.34 39.69,48.9 39.05,49.53 20.95,49.53 20.32,50.17 20.32,63.5 v26.67,63.5
  Bottom 0.254: v26.67,63.5 26.67,73.66 29.21,76.2 29.21,90.17 22.86,90.17 22.86,105.41 17.78,105.41 16.51,106.68 16.51,115.57 11.43,115.57 CONN_MAIN.8
D
  Top 0.254: DEMUX0.20 50.16,47.62 50.8,48.26 76.2,48.26 76.83,47.62 76.83,38.42 77.47,37.78 80.9,37.78 LTRANS1.16
D25(BSRCK)  (via drill 0.61)
  Top 0.254: v105.41,39.05 v105.41,46.99 | v112.08,29.84 110.49,31.43 LTRANS0.5
  Bottom 0.254: v105.41,46.99 JP8.15 | v112.08,29.84 111.44,30.48 111.44,38.42 110.81,39.05 v105.41,39.05
D26(~SRCLR)  (via drill 0.61)
  Top 0.254: JP9.3 93.85,43.31 93.98,43.18 98.42,43.18 99.06,42.55 99.06,32.07 v99.38,31.75 | v107.63,30.8 109.58,30.8 LTRANS0.4
  Bottom 0.254: v99.38,31.75 99.69,32.07 105.73,32.07 107,30.8 v107.63,30.8
D27(BRCK)  (via drill 0.61)
  Top 0.254: JP8.14 99.06,44.45 99.69,43.82 99.69,33.34 v100.01,33.02 | v111.12,28.89 111.12,29.53 110.49,30.16 109.64,30.16 LTRANS0.3
  Bottom 0.254: v100.01,33.02 100.33,32.7 106.68,32.7 107.63,31.75 110.17,31.75 110.81,31.11 110.81,29.21 v111.12,28.89
D28(B~G)  (via drill 0.61)
  Top 0.254: JP9.4 94.11,40.83 94.3,40.64 97.79,40.64 98.42,40.01 98.42,31.11 v99.06,30.48 | v110.49,27.62 109.86,28.26 109.86,28.77 109.8,28.82 LTRANS0.1
  Bottom 0.254: v99.06,30.48 99.69,30.48 100.65,31.43 104.78,31.43 108.58,27.62 v110.49,27.62
D29(PA7)SER_INREG  (via drill 0.61)
  Top 0.254: v112.39,42.23 v112.39,38.1 | v112.39,31.11 111.44,32.07 LTRANS0.6
  Bottom 0.254: JP8.13 111.76,41.91 112.08,42.23 v112.39,42.23 | v112.39,38.1 v112.39,31.11
D30(A)
  Top 0.254: LTRANS1.8 93.5,39.73 JP9.5
D31(B)
  Top 0.254: LTRANS1.7 91.42,39.08 92.39,38.1 95.12,38.1 JP8.12
D32(C)
  Top 0.254: LTRANS1.6 91.11,38.43 92.39,37.15 93.79,37.15 JP9.6
D33(D)
  Top 0.254: LTRANS1.5 90.5,37.78 92.71,35.56 95.38,35.56 JP8.11
D34(E)
  Top 0.254: LTRANS1.4 87.97,37.12 90.81,34.29 JP9.7
D35(F)
  Top 0.254: LTRANS1.3 87.67,36.48 91.12,33.02 95.12,33.02 JP8.10
D36(G)
  Top 0.254: LTRANS1.1 86.74,33.6 88.58,31.75 JP9.8
D37(MAXENABLE)  (via drill 0.61)
  Top 0.254: LTRANS0.10 108.33,34.68 v107.95,34.29 | LTRANS1.10 88.02,41.03 v88.58,41.59
  Bottom 0.254: v107.95,34.29 99.19,34.29 JP8.9 95.38,33.02 92.71,33.02 90.81,34.93 90.81,40.96 90.17,41.59 v88.58,41.59
D42(SW_UNMOUNTED)  (via drill 0.61)
  Top 0.254: v25.72,42.86 38.42,42.86 39.05,42.23 39.05,32.38 39.69,31.75 42.23,31.75 42.86,31.11 v42.86,14.61 | v87.31,24.13 JP9.11
  Bottom 0.254: UNMOUNTED.2 17.14,51.44 v25.72,42.86 | v42.86,14.61 42.86,10.79 43.5,10.16 86.68,10.16 87.31,10.79 v87.31,24.13
D43(LED_UNMOUNTED)  (via drill 0.61)
  Top 0.254: JP8.6 96.52,24.13 96.52,23.5 95.89,22.86 v86.36,22.86 | v77.47,11.11 73.34,6.98 45.4,6.98 45.09,7.3 v42.55,7.3 | v13.97,40.13 R10.2
  Bottom 0.254: v77.47,11.11 85.72,11.11 86.36,11.75 v86.36,22.86 | v42.55,7.3 33.66,7.3 28.26,12.7 14.61,12.7 13.97,13.33 v13.97,40.13
D44(LDBG0)  (via drill 0.61)
  Top 0.254: v91.12,11.11 91.12,10.48 90.17,9.53 90.17,7.94 90.81,7.3 v101.28,7.3 | v101.28,2.86 R7.1
  Bottom 0.254: JP9.12 93.03,21.59 91.12,19.68 v91.12,11.11 | v101.28,7.3 v101.28,2.86
D45(LDBG1)  (via drill 0.61)
  Top 0.254: JP8.5 96.65,20.83 97.79,19.68 97.79,17.78 98.42,17.14 101.92,17.14 103.19,15.88 v104.14,15.88 | v104.14,7.62 104.14,6.67 105.41,5.4 R8.1
  Bottom 0.254: v104.14,7.62 v104.14,15.88
D46(LDBG2)  (via drill 0.61)
  Top 0.254: v99.38,15.88 101.6,15.88 103.5,13.97 103.5,10.16 105.73,7.94 R6.1
  Bottom 0.254: JP9.13 93.98,19.05 95.25,17.78 97.47,17.78 v99.38,15.88
D47(SDSS)  (via drill 0.61)
  Top 0.254: v89.22,20.32 95.12,20.32 JP8.4 | v33.97,17.14 30.59,17.14 U$3.1
  Bottom 0.254: v33.97,17.14 33.97,9.53 34.61,8.89 88.58,8.89 89.22,9.53 v89.22,20.32
D48(WP)  (via drill 0.61)
  Top 0.254: v36.83,15.88 25.08,15.88 20.43,20.52 U$3.CD 20.18,37.96 | v84.77,15.56 93.15,15.56 JP9.14
  Top 0.406: 20.18,37.96 R4.1
  Bottom 0.254: v36.83,15.88 37.15,15.56 v84.77,15.56
D49(CD)  (via drill 0.61)
  Top 0.254: U$3.WP 16.42,37.95 18.1,37.85 | R5.1 18.41,46.38 18.41,37.78 18.1,37.85 | JP8.3 96.52,16.51 95.25,17.78 v85.41,17.78 | v37.47,18.1 37.15,18.41 27.3,18.41 v26.99,18.73 | v18.1,34.93 18.1,37.85
  Bottom 0.254: v85.41,17.78 83.19,17.78 82.23,16.83 38.73,16.83 v37.47,18.1 | v26.99,18.73 20.32,18.73 18.1,20.95 v18.1,34.93
D50(MISO)  (via drill 0.61)
  Top 0.254: LTRANS0.9 113.3,34.03 115.89,31.43 115.89,24.13 111.76,20 102.23,20 101.92,19.68 100.33,19.68 99.69,20.32 99.69,21.59 100.01,21.91 v100.33,21.91 | U$3.7 25.82,32.17 v25.72,32.07 | v85.41,13.97 JP9.15
  Bottom 0.254: JP9.15 95.12,15.24 97.79,15.24 98.42,14.61 100.33,14.61 100.33,18.41 99.69,19.05 99.69,21.59 100.01,21.91 v100.33,21.91 | v25.72,32.07 25.72,21.59 26.35,20.95 35.24,20.95 35.88,20.32 35.88,16.83 37.47,16.83 38.1,16.19 83.5,16.19 84.14,16.83 85.09,16.83 85.72,16.19 85.72,14.29 v85.41,13.97
D51(MOSI)  (via drill 0.61)
  Top 0.254: LTRANS0.8 112.99,33.38 115.25,31.11 115.25,24.45 111.44,20.64 v100.65,20.64 | v88.27,12.7 95.12,12.7 JP8.2 | v32.38,19.68 30.55,19.68 U$3.2
  Bottom 0.254: v32.38,19.68 34.29,19.68 34.92,19.05 34.92,10.16 35.56,9.53 87.63,9.53 88.27,10.16 v88.27,12.7 | JP8.2 100.97,13.97 100.97,18.73 100.65,19.05 v100.65,20.64
D52(SCK)  (via drill 0.61)
  Top 0.254: LTRANS0.7 112.69,32.73 114.62,30.8 114.62,24.77 111.12,21.27 102.23,21.27 v101.6,21.91 | v46.35,7.94 46.04,8.26 40.32,8.26 40.32,26.04 39.69,26.67 31.07,26.67 U$3.5 | v91.76,8.26 91.76,9.08 JP9.16
  Bottom 0.254: v91.76,8.26 46.35,8.26 v46.35,7.94 | JP9.16 94.11,11.56 95.25,12.7 101.6,12.7 v101.6,21.91
D53(SS)  (via drill 0.61)
  Top 0.254: LTRANS1.9 89.27,40.38 v89.53,40.64
  Bottom 0.254: v89.53,40.64 90.17,40.01 90.17,10.79 90.81,10.16 96.65,10.16 JP8.1
E
  Top 0.254: DEMUX1.23 65.09,23.44 65.09,36.51 65.72,37.15 80.9,37.15 LTRANS1.17
F
  Top 0.254: DEMUX1.22 66.04,35.88 66.67,36.51 80.9,36.51 LTRANS1.18
G  (via drill 0.61)
  Top 0.254: LTRANS1.20 80.64,35.18 v80.64,32.38 | DEMUX1.21 67.31,31.75 67.94,32.38 v74.3,32.38
  Bottom 0.254: v74.3,32.38 v80.64,32.38
GND  (via drill 0.61)  (1 unrouted)
  Top 0.254: LTRANS1.11 82.3,41.03 83.19,41.91 | 93.03,30.48 97.79,30.48 | 92.71,27.94 97.79,27.94 | 92.71,25.4 97.79,25.4
  Bottom 0.254: 94.23,98.68 v93.6,99.31
  Bottom 1.016: v104.97,53.02 v110.68,53.02 | v99.06,4.76 v99.06,8.26 | v81.22,12.38 v84.01,12.38 | v19.37,22.86 v21.59,22.86
  Bottom 2.54: v66.42,104.65 v66.42,118.49
  Bottom 3.81: v97.54,87.25 94.23,98.68
  other vias: 66.42,106.81 66.42,116.33 96.14,88.77 98.17,89.28 93.6,97.16 95.38,98.42
  pour Top (isolate 0.406): 0,0 146.05,0 146.05,128.27 0,128.27
L0
  Top 0.254: JP1.3 123.19,16.51 123.83,17.14 PWRREG3.17
L1  (via drill 0.61)
  Top 0.254: v112.39,15.24 113.67,15.24 114.3,15.88 124.46,15.88 125.09,16.51 PWRREG3.16
  Bottom 0.254: JP1.2 107.63,14.61 108.27,15.24 v112.39,15.24
L2
  Top 0.254: PWRREG3.15 126.36,15.88 125.73,15.24 115.25,15.24 114.3,14.29 110.49,14.29 JP1.1
MISO5V  (via drill 0.61)
  Top 0.254: v101.92,49.85 101.92,49.21 102.55,48.58 102.55,34.61 103.14,34.03 LTRANS0.12 | v93.98,111.76 CONN_8-11.11 78.74,110.49 74.93,110.49 73.66,111.76 CONN_4-7.11 57.15,110.49 53.34,110.49 52.07,111.76 CONN_0-3.11 34.29,110.49 19.05,110.49 19.05,107.95 10.16,107.95 CONN_MAIN.4
  Bottom 0.254: v101.92,49.85 101.92,55.56 93.03,55.56 90.04,55.63 90.17,66.36 90.11,100.46 90.11,104.46 90.17,106.68 96.52,110.49 | 96.52,110.49 99.06,110.49 99.06,111.76 CONN_12-15.11 121.92,90.17 127,90.17 CONN_16-19.11 | v93.98,111.76 95.25,111.76 96.52,110.49
MOSI5V  (via drill 0.61)
  Top 0.254: LTRANS0.13 102.83,33.38 101.92,34.29 101.92,47.94 100.33,49.53 100.33,52.07 99.06,53.34 90.17,53.34 86.36,57.15 v85.09,57.15 | 88.9,109.22 CONN_8-11.9 78.74,107.95 74.93,107.95 73.66,109.22 CONN_4-7.9 57.15,107.95 53.34,107.95 52.07,109.22 CONN_0-3.9 33.02,107.95 v20.32,107.95 | 88.9,109.22 96.52,109.22 96.52,107.95 99.06,107.95 CONN_12-15.9 | 88.9,109.22 v88.9,107.95 | CONN_MAIN.9 v20.32,116.84
  Bottom 0.254: CONN_16-19.9 125.73,87.63 121.92,87.63 CONN_12-15.9 | v85.09,57.15 82.55,57.15 78.74,60.96 78.74,85.09 81.28,87.63 81.28,92.71 87.63,99.06 87.63,106.68 v88.9,107.95 | v20.32,116.84 v20.32,107.95
N$1  (via drill 0.61)
  Top 0.254: v122.56,52.07 PWRREG0.18 | PWRREG2.3 v122.56,29.53
  Bottom 0.254: v122.56,29.53 122.56,32.07 124.46,33.97 124.46,51.44 123.83,52.07 v122.56,52.07
N$2  (via drill 0.61)
  Top 0.254: PWRREG2.18 122.56,34.61 v121.28,33.34 | PWRREG3.3 v122.56,13.02
  Bottom 0.254: v121.28,33.34 121.28,17.78 121.92,17.14 128.91,17.14 129.54,16.51 129.54,15.24 127.64,13.33 122.87,13.33 v122.56,13.02
N$7
  Top 0.254: R6.2 DBG2.A
N$8
  Top 0.254: R7.2 DBG0.A
N$9
  Top 0.254: R8.2 DBG1.A
N$11
  Top 0.254: MOUNT.A R10.1
N$126
  Top 0.254: R1.1 27.3,5.85 UCPW.A
S00  (via drill 0.61)
  Top 0.254: PWRREG0.4 123.83,46.99 123.19,47.62 108.58,47.62 107.31,48.9 107.31,59.69 106.68,60.33 62.23,60.33 61.59,60.96 61.59,62.23 60.96,62.87 43.18,62.87 42.55,63.5 42.55,69.21 v40.64,71.12
  Bottom 0.254: v40.64,71.12 40.64,107.95 31.75,107.95 CONN_0-3.10
S01  (via drill 0.61)
  Top 0.254: PWRREG0.5 125.09,47.31 124.14,48.26 109.22,48.26 107.95,49.53 107.95,60.33 107.31,60.96 62.87,60.96 62.23,61.6 62.23,62.87 61.59,63.5 43.81,63.5 43.18,64.14 43.18,72.01 42.29,73.28 v41.91,73.41
  Bottom 0.254: v41.91,73.41 41.91,110.49 33.02,110.49 CONN_0-3.12
S02  (via drill 0.61)
  Top 0.254: PWRREG0.6 126.36,47.62 125.09,48.9 109.86,48.9 108.58,50.17 108.58,60.96 107.95,61.6 63.5,61.6 62.87,62.23 62.87,63.5 62.23,64.14 44.45,64.14 43.81,64.77 43.81,74.3 v43.18,74.93
  Bottom 0.254: v43.18,74.93 43.18,113.03 33.02,113.03 CONN_0-3.14
S03  (via drill 0.61)
  Top 0.254: PWRREG0.7 127.64,47.94 126.05,49.53 110.49,49.53 109.22,50.8 109.22,61.6 108.58,62.23 64.14,62.23 63.5,62.87 63.5,64.14 62.87,64.77 45.09,64.77 44.45,65.41 v44.45,76.2
  Bottom 0.254: v44.45,76.2 44.45,115.57 33.02,115.57 CONN_0-3.16
S04  (via drill 0.61)
  Top 0.254: PWRREG0.17 123.83,57.79 123.19,58.42 110.49,58.42 109.86,59.05 109.86,62.23 109.22,62.87 64.77,62.87 64.14,63.5 64.14,69.21 63.5,69.85 62.23,69.85 v60.96,71.12
  Bottom 0.254: v60.96,71.12 60.96,106.68 59.69,107.95 55.88,107.95 CONN_4-7.10
S05  (via drill 0.61)
  Top 0.254: PWRREG0.16 125.09,58.42 124.46,59.05 111.12,59.05 110.49,59.69 110.49,62.87 109.86,63.5 65.41,63.5 64.77,64.14 64.77,70.48 64.14,71.12 63.5,71.12 v62.23,72.39
  Bottom 0.254: CONN_4-7.12 55.88,110.49 60.96,110.49 61.85,110.11 61.85,74.17 62.23,73.28 v62.23,72.39
S06  (via drill 0.61)
  Top 0.254: PWRREG0.15 126.36,59.05 125.73,59.69 111.76,59.69 111.12,60.33 111.12,63.5 110.49,64.14 66.04,64.14 65.41,64.77 65.41,72.39 v63.88,73.91
  Bottom 0.254: CONN_4-7.14 54.61,113.03 62.61,113.16 62.61,75.82 63.88,74.04 v63.88,73.91
S07  (via drill 0.61)
  Top 0.254: PWRREG0.14 127.64,59.69 127,60.33 112.39,60.33 111.76,60.96 111.76,64.14 111.12,64.77 66.67,64.77 66.04,65.41 66.04,74.3 v65.41,74.93
  Bottom 0.254: 56.35,118.81 CONN_4-7.16 | 56.35,118.81 56.52,119 | v65.41,74.93 64.77,74.93 63.5,76.2 63.5,118.62 63.25,118.87 58.95,118.87 56.35,118.81
S08  (via drill 0.61)
  Top 0.254: PWRREG2.4 123.83,28.57 v124.46,29.21
  Bottom 0.254: v124.46,29.21 124.46,31.75 125.73,33.02 125.73,52.07 137.16,63.5 137.16,86.36 127.76,95.88 126.62,95.88 104.9,118.36 89.53,118.36 80.01,107.95 76.2,107.95 CONN_8-11.10
S09  (via drill 0.61)
  Top 0.254: PWRREG2.5 125.09,27.94 127,29.84 132.08,29.84 133.99,31.75 v135.89,31.75
  Bottom 0.254: v135.89,31.75 137.79,31.75 138.43,32.38 138.43,87.63 129.16,96.9 126.87,96.9 105.41,119.63 88.39,119.63 80.01,110.49 76.2,110.49 CONN_8-11.12
S10  (via drill 0.61)
  Top 0.254: PWRREG2.6 126.36,27.94 127.64,29.21 133.03,29.21 v134.3,30.48
  Bottom 0.254: v134.3,30.48 138.43,30.48 139.32,30.99 139.32,88.52 130.05,97.79 127.38,97.79 105.92,120.78 87.5,120.78 80.01,113.03 76.2,113.03 CONN_8-11.14
S11  (via drill 0.61)
  Top 0.254: PWRREG2.7 127.64,27.94 128.27,28.57 135.25,28.57 v135.89,29.21
  Bottom 0.254: v135.89,29.21 139.06,29.21 140.21,29.84 140.21,89.03 130.43,98.81 127.89,98.81 106.17,122.05 86.87,122.05 80.01,115.57 76.2,115.57 CONN_8-11.16
S12
  Top 0.254: PWRREG2.17 123.83,38.74 124.46,39.37 133.67,39.37 134.94,40.64 134.94,61.91 133.67,63.18 118.81,63.18 117.54,64.45 117.54,67.82 112.27,73.09 111.95,73.47 111.95,77.16 111.7,77.41 | 111.7,77.41 105.41,83.82 105.41,109.22 104.14,110.49 97.79,110.49 CONN_12-15.10 | 111.7,77.41 112.01,77.09
S13
  Top 0.254: PWRREG2.16 125.09,38.1 125.73,38.74 134.3,38.74 135.57,40.01 135.57,62.55 134.3,63.82 119.57,63.82 118.3,65.09 118.3,68.13 112.78,73.66 112.78,77.47 106.68,83.82 106.68,110.49 104.14,113.03 97.79,113.03 CONN_12-15.12
S14
  Top 0.254: PWRREG2.15 126.36,37.47 127,38.1 134.94,38.1 136.21,39.37 136.21,63.18 134.94,64.45 120.33,64.45 119.06,65.72 119.06,68.58 113.54,73.98 113.54,78.1 107.95,83.82 107.95,111.76 104.14,115.57 97.79,115.57 CONN_12-15.14
S15
  Top 0.254: PWRREG2.14 127.64,36.83 128.27,37.47 135.57,37.47 136.84,38.74 136.84,63.82 135.57,65.09 120.97,65.09 119.7,66.36 119.7,68.9 114.3,74.3 114.3,78.74 109.22,83.82 109.22,111.76 101.6,119.38 97.79,119.38 CONN_12-15.16
S16
  Top 0.254: PWRREG3.7 127.64,7.62 128.27,6.98 135.57,6.98 137.79,13.02 137.79,79.25 129.54,87.63 124.46,87.63 CONN_16-19.10
S17
  Top 0.254: PWRREG3.6 126.36,6.98 127,6.35 136.21,6.35 138.43,12.38 138.43,68.26 138.37,81.34 129.54,90.17 124.46,90.17 CONN_16-19.12
S18
  Top 0.254: PWRREG3.5 125.09,6.35 125.73,5.71 136.84,5.71 139.06,11.75 139.06,72.39 139.06,83.19 129.54,92.71 124.46,92.71 CONN_16-19.14
S19
  Top 0.254: PWRREG3.4 123.83,5.71 124.46,5.08 137.48,5.08 139.7,11.11 139.7,85.09 129.54,95.25 124.46,95.25 CONN_16-19.16
SCK5V  (via drill 0.61)
  Top 0.254: LTRANS0.14 102.53,32.73 101.28,33.97 101.28,46.67 98.74,49.21 98.87,52.01 97.79,52.07 88.9,52.07 88.9,53.34 86.36,55.88 v82.55,55.88 | v93.98,113.03 80.01,113.03 CONN_8-11.13 78.74,113.03 74.93,113.03 73.66,114.3 CONN_4-7.13 57.15,113.03 53.34,113.03 52.07,114.3 CONN_0-3.13 34.29,113.03 17.78,113.03 17.78,110.49 10.16,110.49 CONN_MAIN.6
  Bottom 0.254: CONN_16-19.13 125.73,92.71 121.92,92.71 CONN_12-15.13 100.33,113.03 v93.98,113.03 88.9,113.03 86.36,110.49 86.36,99.06 80.01,92.71 80.01,87.63 77.47,85.09 77.47,60.96 v82.55,55.88
SER_INREG  (via drill 0.61)
  Top 0.254: v117.16,37.15 106.05,37.15 105.41,36.51 105.41,32.7 104.78,32.07 LTRANS0.15 | v122.56,42.55 PWRREG0.3
  Bottom 0.254: v117.16,37.15 119.06,37.15 120.33,38.42 120.33,40.96 121.92,42.55 v122.56,42.55
SMAIN  (via drill 0.61)
  Top 0.254: v127.64,16.19 PWRREG3.14 | v115.57,45.09 115.57,46.99 107.95,46.99 106.68,48.26 106.68,59.05 106.05,59.69 61.59,59.69 60.96,60.33 60.96,61.6 60.33,62.23 42.55,62.23 41.91,62.87 41.91,64.45 41.27,65.09 v27.94,65.09
  Bottom 0.254: v115.57,45.09 115.57,15.88 116.2,15.24 127,15.24 127.64,15.88 v127.64,16.19 | v27.94,65.09 27.94,71.12 30.48,73.66 30.48,91.44 24.13,91.44 24.13,106.68 19.05,106.68 17.78,107.95 17.78,119.38 10.16,119.38 CONN_MAIN.10
SS5V  (via drill 0.61)
  Top 0.254: DEMUX0.18 DEMUX0.19 51.44,46.99 52.07,47.62 74.93,47.62 75.56,46.99 v75.56,42.55 | v80.01,42.55 79.38,41.91 79.38,40.96 80.01,40.32 80.9,40.32 LTRANS1.12
  Bottom 0.254: v75.56,42.55 v80.01,42.55
SS5V-2  (via drill 0.61)
  Top 0.254: DEMUX1.19 DEMUX1.18 v71.12,26.04 | v71.12,38.1 71.12,46.36 70.48,46.99 54.61,46.99 53.98,46.36 DEMUX0.17
  Bottom 0.254: v71.12,26.04 v71.12,38.1

### Text on the board
tPlace: SWMAIN | MOSI | SW3 | CS0 | SW7 | SC4 | SW12 | CS8 | SW15 | CS12 | CSMAIN | GND | SW2 | SCK | SW6 | SCK | SW11 | SCK | SW14 | SCK | SCK | GND | SW1 | MISO | SW5 | MISO | SW10 | MISO | SW13 | MISO | MISO | +5V | SW0 | MOSI | SW4 | MOSI | SW9 | MOSI | SW12 | MOSI | GND | GND | +5V | +5V | CS3 | SC7 | GND | SW8 | CS15 | GND | CS2 | GND | SC6 | GND | CS11 | GND | CS14 | GND | +5V | 10uF | CS1 | +5V | SC5 | +5V | CS10 | +5V | CS13 | +5V | +5V | +5V | +5V | CS9 | +5V | +5V | +5V | - | SW19 | CS16 | SW18 | SCK | + | SW17 | MISO | SW16 | MOSI | GND | CS19 | GND | CS18 | +5V | CS17 | +5V | +5V | 100uF | 22 | 23 | 24 | 25 | 1 | 26 | 27 | 28 | 29 | 30 | 31 | 32 | 33 | 1 | 34 | 35 | 36 | 37 | 1 | 38 | 39 | 1 | 40 | 41 | 1 | 42 | 43 | 44 | 45 | 46 | 47 | 48 | 49 | 50 | 51 | 1 | 52 | 53 | 1 | .1uF
tNames: v0.2 | AREF | GND | PB7 | PB6 | PB5 | PB4 | PH6 | PH5 | PH4 | PH3 | PE3 | PG5 | PE5 | PE4 | PE1 | PE0 | TXD3 | RXD3 | TXD2 | RXD2 | TXD1 | RXD1 | SDA | SCL | 13 | 12 | 11 | 10 | 09 | 08 | 07 | 06 | 05 | 04 | 03 | 02 | 01 | 00 | PA0/1 | PA2/3 | PWM | PA4/5 | PA6/7 | PC7/6 | PC5/4 | PC3/2 | PC1/0 | PD7/PG2 | PG1/0 | PL7/6 | PL5/4 | PL3/2 | PL1/0 | PB2/3 | PB0/1 | RST | 3.6VMDM | 3.6VMega | GND | GND | VIN? | 0 | 1 | 2 | 3 | 4 | 5 | 6 | 7 | 8 | 9 | 10 | 11 | 12 | 13 | 14 | 15 | PortK/ADC
Telduino: TELDUINO